# Altium schematic sheet BH1750.SchDoc
size A
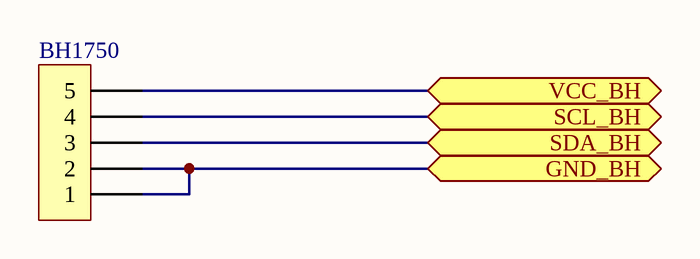
[diagram p0: BH1750.SchDoc]

## Parts
BH1750  Header 5P 2.54 Duc Thang  [XH2.54M-5]  (value not drawn)

## Ports
GND_BH (bidir), SCL_BH (bidir), SDA_BH (bidir), VCC_BH (bidir)

## Nets
GND_BH: BH1750.1 BH1750.2 ; port GND_BH
SCL_BH: BH1750.4 ; port SCL_BH
SDA_BH: BH1750.3 ; port SDA_BH
VCC_BH: BH1750.5 ; port VCC_BH

## Library data of the parts
BH1750 = Header 5P 2.54 Duc Thang: Cắm; Ten_Linh_Kien: Header 5P XH2.54-5P Đực Thẳng; Don_Vi: Con; Ma_Hang: MH001298; Chung_Loai: Cắm